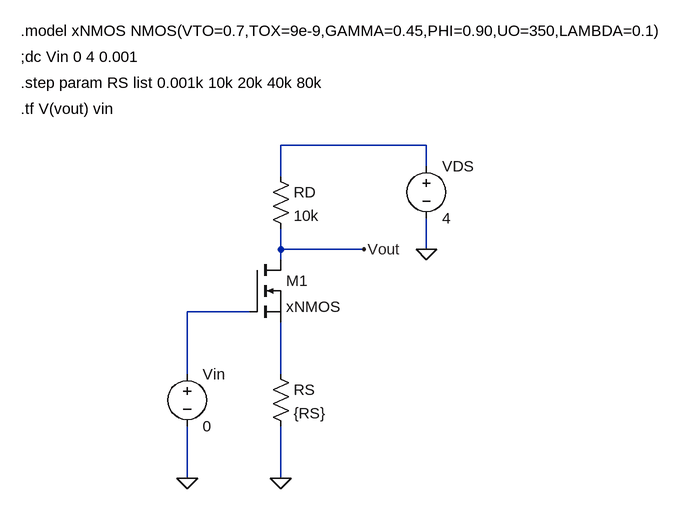
[diagram p0: schematic Chapter03_SPICE05.asc]
Chapter03_SPICE05.asc, the LTspice schematic file:
Version 4
SHEET 1 1244 868
WIRE 672 336 448 336
WIRE 672 368 672 336
WIRE 448 384 448 336
WIRE 448 496 448 464
WIRE 576 496 448 496
WIRE 672 496 672 448
WIRE 448 512 448 496
WIRE 400 592 304 592
WIRE 304 688 304 592
WIRE 448 688 448 608
WIRE 304 848 304 768
WIRE 448 848 448 768
FLAG 448 848 0
FLAG 304 848 0
FLAG 672 496 0
FLAG 576 496 Vout
SYMBOL nmos 400 512 R0
SYMATTR InstName M1
SYMATTR Value xNMOS
SYMBOL voltage 304 672 R0
WINDOW 123 0 0 Left 0
WINDOW 39 0 0 Left 0
SYMATTR InstName Vin
SYMATTR Value 0
SYMBOL voltage 672 352 R0
WINDOW 123 0 0 Left 0
WINDOW 39 0 0 Left 0
SYMATTR InstName VDS
SYMATTR Value 4
SYMBOL res 432 368 R0
SYMATTR InstName RD
SYMATTR Value 10k
SYMBOL res 432 672 R0
SYMATTR InstName RS
SYMATTR Value {RS}
TEXT 48 160 Left 2 !.model xNMOS NMOS(VTO=0.7,TOX=9e-9,GAMMA=0.45,PHI=0.90,UO=350,LAMBDA=0.1)
TEXT 48 200 Left 2 !;dc Vin 0 4 0.001
TEXT 48 240 Left 2 !.step param RS list 0.001k 10k 20k 40k 80k
TEXT 48 280 Left 2 !.tf V(vout) vin

The netlist it stands for:
* Chapter03_SPICE05.asc
M1 Vout N002 N003 N003 xNMOS
Vin N002 0 0
VDS N001 0 4
RD N001 Vout 10k
RS N003 0 {RS}
.model NMOS NMOS
.model PMOS PMOS
.lib standard.mos
.model xNMOS NMOS(VTO=0.7,TOX=9e-9,GAMMA=0.45,PHI=0.90,UO=350,LAMBDA=0.1)
;dc Vin 0 4 0.001
.step param RS list 0.001k 10k 20k 40k 80k
.tf V(vout) vin
.backanno
.end